# EAGLE design trans-emu (EAGLE 9.6.2)
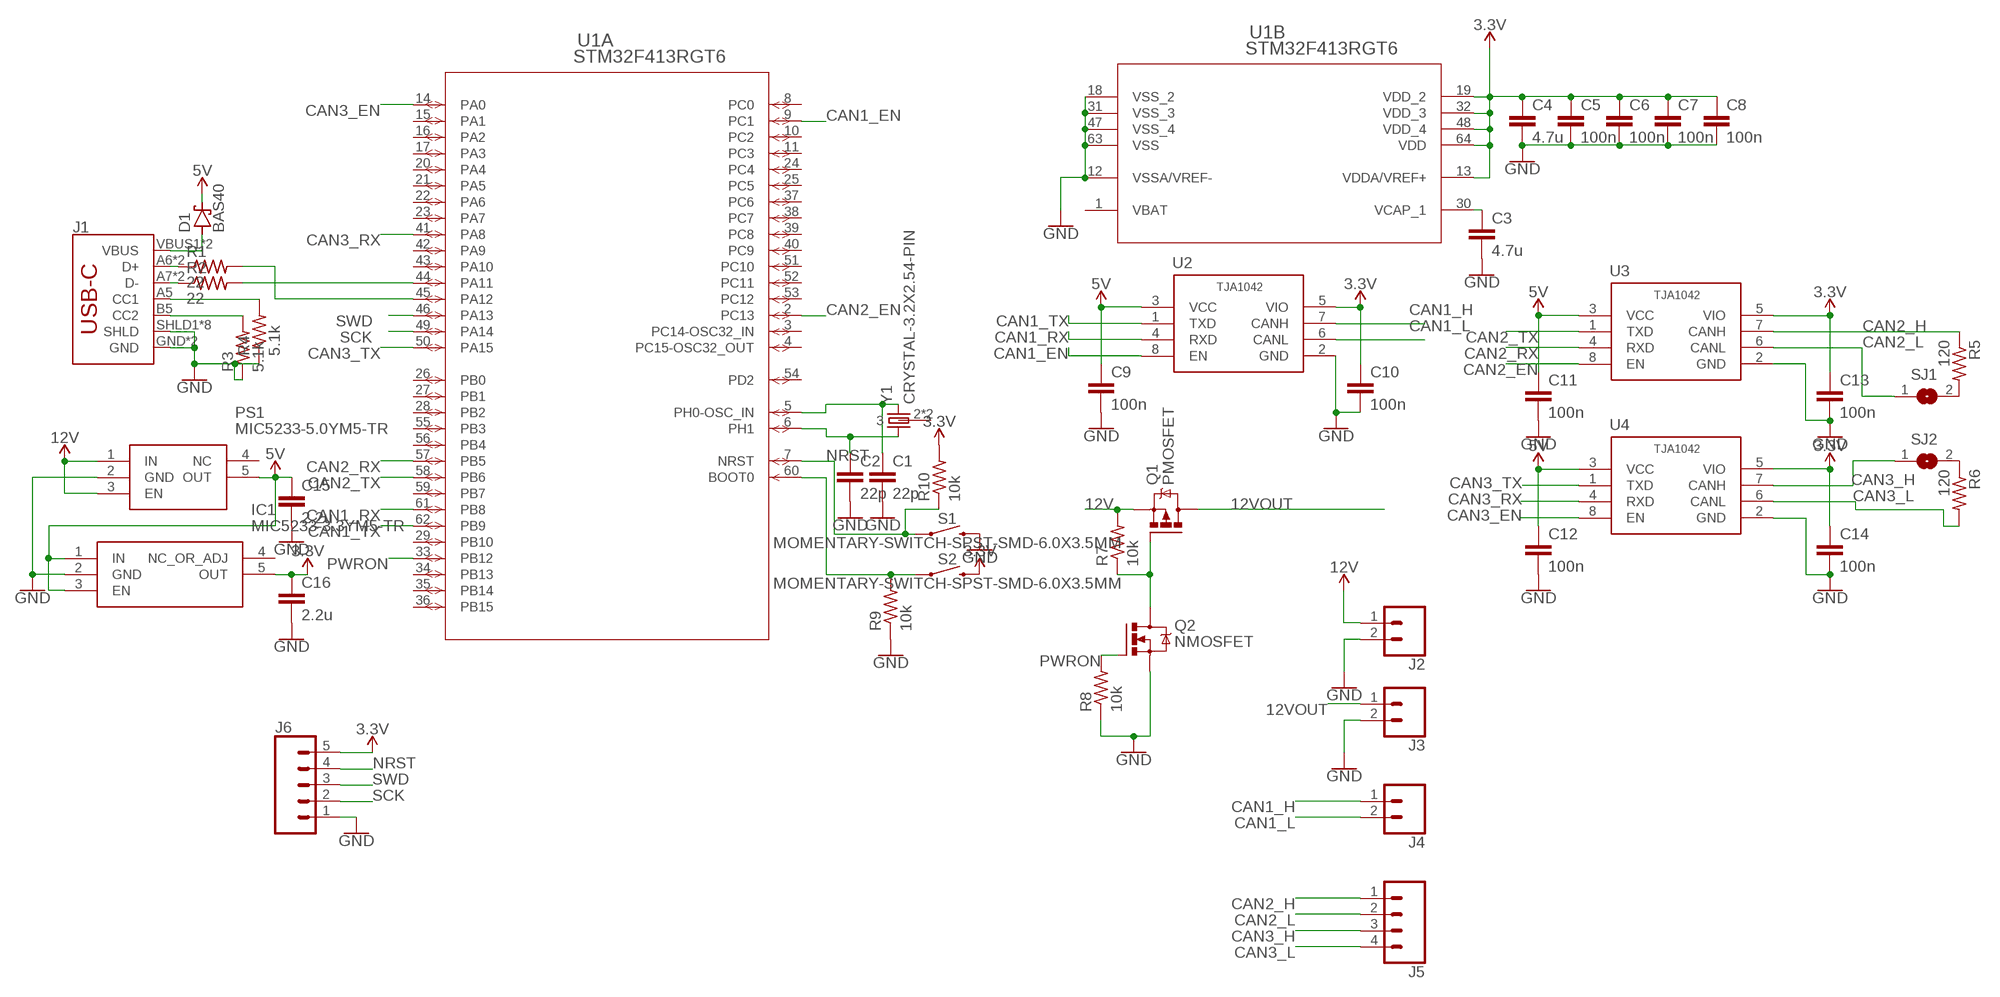
[diagram p0: schematic, sheet 1]

## Parts
C1  22p  C0603  [0603-C]
C2  22p  C0603  [0603-C]
C3  4.7u  C0603  [0603-C]
C4  4.7u  C0603  [0603-C]
C5  100n  C0603  [0603-C]
C6  100n  C0603  [0603-C]
C7  100n  C0603  [0603-C]
C8  100n  C0603  [0603-C]
C9  100n  C0603  [0603-C]
C10  100n  C0603  [0603-C]
C11  100n  C0603  [0603-C]
C12  100n  C0603  [0603-C]
C13  100n  C0603  [0603-C]
C14  100n  C0603  [0603-C]
C15  2.2u  C0603  [0603-C]
C16  2.2u  C0603  [0603-C]
D1  BAS40  [SOT23]
IC1  MIC5233-3.3YM5-TR  [SOT95P280X145-5N]
J1  USB-C-BREAKOUT_SPARKFUN-CONNECTORS_USB_C16PIN  [USB-C-BREAKOUT_SPARKFUN-CONNECTORS_USB-C-16P]
J2  CONN_02  [1X02]
J3  CONN_02  [1X02]
J4  CONN_02  [1X02]
J5  CONN_04  [1X04]
J6  CONN_051.27MM  [1X05_1.27MM]
PS1  MIC5233-5.0YM5-TR  [SOT95P280X145-5N]
Q1  PMOSFET  PMOSFET_SOT23  [SOT23]
Q2  NMOSFET  NMOSFETSOT23  [SOT23]
R1  22  R0402  [0402-R]
R2  22  R0402  [0402-R]
R3  5.1k  R0402  [0402-R]
R4  5.1k  R0402  [0402-R]
R5  120  R0402  [0402-R]
R6  120  R0402  [0402-R]
R7  10k  R0402  [0402-R]
R8  10k  R0402  [0402-R]
R9  10k  R0402  [0402-R]
R10  10k  R0402  [0402-R]
S1  MOMENTARY-SWITCH-SPST-SMD-6.0X3.5MM  [TACTILE_SWITCH_SMD_6.0X3.5MM]
S2  MOMENTARY-SWITCH-SPST-SMD-6.0X3.5MM  [TACTILE_SWITCH_SMD_6.0X3.5MM]
SJ1  SJ  [SJ]
SJ2  SJ  [SJ]
U1  STM32F413RGT6  [LQFP64-10X10MM]
U2  TJA1042  [NXP_SEMICONDUCTORS_TJA1042T-3-CM_118_0]
U3  TJA1042  [NXP_SEMICONDUCTORS_TJA1042T-3-CM_118_0]
U4  TJA1042  [NXP_SEMICONDUCTORS_TJA1042T-3-CM_118_0]
Y1  CRYSTAL-3.2X2.54-PIN  [XTAL-3.2X2.5]

## Nets
3.3V: C4.1 C5.1 C6.1 C7.1 C8.1 C10.1 C13.1 C14.1 C16.1 IC1.5(OUT) J6.5 R10.2 S2.2 U1.13(B:VDDA/VREF+) U1.19(B:VDD_2) U1.32(B:VDD_3) U1.48(B:VDD_4) U1.64(B:VDD) U2.5(VIO) U3.5(VIO) U4.5(VIO)
5V: C9.1 C11.1 C12.1 C15.1 D1.3(C) IC1.1(IN) IC1.3(EN) PS1.5(OUT) U2.3(VCC) U3.3(VCC) U4.3(VCC)
12V: J2.1 PS1.1(IN) PS1.3(EN) Q1.2(S) R7.2
12VOUT: J3.1 Q1.3(D)
CAN1_EN: U1.9(A:PC1) U2.8(EN)
CAN1_H: J4.1 U2.7(CANH)
CAN1_L: J4.2 U2.6(CANL)
CAN1_RX: U1.61(A:PB8) U2.4(RXD)
CAN1_TX: U1.62(A:PB9) U2.1(TXD)
CAN2_EN: U1.2(A:PC13) U3.8(EN)
CAN2_H: J5.1 R5.1 U3.7(CANH)
CAN2_L: J5.2 SJ1.1 U3.6(CANL)
CAN2_RX: U1.57(A:PB5) U3.4(RXD)
CAN2_TX: U1.58(A:PB6) U3.1(TXD)
CAN3_EN: U1.14(A:PA0) U4.8(EN)
CAN3_H: J5.3 SJ2.1 U4.7(CANH)
CAN3_L: J5.4 R6.2 U4.6(CANL)
CAN3_RX: U1.41(A:PA8) U4.4(RXD)
CAN3_TX: U1.50(A:PA15) U4.1(TXD)
GND: C1.2 C2.2 C3.2 C4.2 C5.2 C6.2 C7.2 C8.2 C9.2 C10.2 C11.2 C12.2 C13.2 C14.2 C15.2 C16.2 IC1.2(GND) J1.GND J1.GND2(GND) J1.SHLD1(SHLD) J1.SHLD2(SHLD) J1.SHLD3(SHLD) J1.SHLD4(SHLD) J1.SHLD5(SHLD) J1.SHLD6(SHLD) J1.SHLD7(SHLD) J1.SHLD8(SHLD) J2.2 J3.2 J6.1 PS1.2(GND) Q2.2(S) R3.1 R4.1 R8.1 R9.1 S1.2 U1.12(B:VSSA/VREF-) U1.18(B:VSS_2) U1.31(B:VSS_3) U1.47(B:VSS_4) U1.63(B:VSS) U2.2(GND) U3.2(GND) U4.2(GND)
N$1: C1.1 U1.5(A:PH0-OSC_IN) Y1.3
N$2: C2.1 U1.6(A:PH1) Y1.1
N$3: R2.2 U1.44(A:PA11)
N$4: R1.2 U1.45(A:PA12)
N$5: D1.1(A) J1.VBUS1(VBUS) J1.VBUS2(VBUS)
N$6: J1.A5(CC1) R4.2
N$7: J1.B5(CC2) R3.2
N$9: R9.2 S2.1 U1.60(A:BOOT0)
N$10: J1.A6(D+) J1.B6(D+) R1.1
N$11: J1.A7(D-) J1.B7(D-) R2.1
N$12: R5.2 SJ1.2
N$13: C3.1 U1.30(B:VCAP_1)
N$14: R6.1 SJ2.2
N$16: Q1.1(G) Q2.3(D) R7.1
NRST: J6.4 R10.1 S1.1 U1.7(A:NRST)
PWRON: Q2.1(G) R8.2 U1.33(A:PB12)
SCK: J6.2 U1.49(A:PA14)
SWD: J6.3 U1.46(A:PA13)
Unconnected: IC1.4(NC_OR_ADJ) PS1.4(NC) U1.3(A:PC14-OSC32_IN) U1.4(A:PC15-OSC32_OUT) U1.8(A:PC0) U1.10(A:PC2) U1.11(A:PC3) U1.15(A:PA1) U1.16(A:PA2) U1.17(A:PA3) U1.20(A:PA4) U1.21(A:PA5) U1.22(A:PA6) U1.23(A:PA7) U1.24(A:PC4) U1.25(A:PC5) U1.26(A:PB0) U1.27(A:PB1) U1.28(A:PB2) U1.29(A:PB10) U1.34(A:PB13) U1.35(A:PB14) U1.36(A:PB15) U1.37(A:PC6) U1.38(A:PC7) U1.39(A:PC8) U1.40(A:PC9) U1.42(A:PA9) U1.43(A:PA10) U1.51(A:PC10) U1.52(A:PC11) U1.53(A:PC12) U1.54(A:PD2) U1.55(A:PB3) U1.56(A:PB4) U1.59(A:PB7) Y1.2 Y1.4

## Power pins joined to a net without a drawn wire
VBAT: U1.1(B:VBAT)

## Library data of the parts
C1-C16 = comma.ai:C
D1 = diode:BAS40: Silicon Schottky Diodes General-purpose diode for high-speed switching
IC1 = SamacSys_Parts:MIC5233-3.3YM5-TR: High Input Voltage Low IQ UCAP LDO Regulator Source: Datasheet <http://ww1.microchip.com/downloads/en/DeviceDoc/MIC5233-Data-Sheet-DS20006033D.pdf>; DESCRIPTION: High Input Voltage Low IQ UCAP LDO Regulator; HEIGHT: 1.45mm; MANUFACTURER_NAME: Microchip; MANUFACTURER_PART_NUMBER: MIC5233-3.3YM5-TR; MOUSER_PART_NUMBER: 998-MIC5233-3.3YM5TR; MOUSER_PRICE-STOCK: https://www.mouser.co.uk/ProductDetail/Microchip-Technology-Micrel/MIC5233-33YM5-TR?qs=U6T8BxXiZAWDhshLMgpaLQ%3D%3D
J1 = ROTR-Wireless:USB-C-BREAKOUT_SPARKFUN-CONNECTORS_USB_C: USB Type C 16Pin Connector Super Speed pins not available on the 16-pin purely SMD connector so this part is best for USB 2.0 implementations. D1 and D2 are tied together enabling D+/- no matter which way the cable is plugged into the connector. The two channel configuration pins (CC1/2) are exposed. These are normally connected to ground via 5.1k resistors but can be reconfigured for high current/high power applications.; PROD_ID: CONN-14122
J2-J4 = SparkFun-Connectors:CONN_02: Multi connection point. Often used as Generic Header-pin footprint for 0.1 inch spaced/style header connections On any of the 0.1 inch spaced packages, you can populate with these: Break Away Headers - Straight <https://www.sparkfun.com/products/116> (PRT-00116) Break Away Male Headers - Right Angle <https://www.sparkfun.com/products/553> (PRT-00553) Female Headers <https://www.sparkfun.com/products/115> (PRT-00115) Break Away Headers - Machine Pin <https://www.sparkfun.com/products/117> (PRT-00117) Break Away Female Headers - Swiss Machine Pin <https://www.sparkfun.com/products/743> (PRT-00743) For SCREWTERMINALS and SPRING TERMINALS visit here: Screw Terimnals on SparkFun.com <https://www.sparkfun.com/search/results?term=Screw+Terminals> (5mm/3.5mm/2.54mm spacing) This device is also useful as a general connection point to wire up your design to another part of your project. Our various solder wires solder well into these plated through hole pads. Hook-Up Wire - Assortment (Stranded, 22 AWG) <https://www.sparkfun.com/products/11375> (PRT-11375) Hook-Up Wire - Assortment (Solid Core, 22 AWG) <https://www.sparkfun.com/products/11367> (PRT-11367) View the entire wire category on our website here <https://www.sparkfun.com/categories/141> Special notes: Molex polarized connector foot print use with: PRT-08233 with associated crimp pins and housings. 2.54_SCREWTERM for use with PRT-10571. 3.5mm Screw Terminal footprints for PRT-08084 5mm Screw Terminal footprints for use with PRT-08432
J5 = SparkFun-Connectors:CONN_04: Multi connection point. Often used as Generic Header-pin footprint for 0.1 inch spaced/style header connections On any of the 0.1 inch spaced packages, you can populate with these: Break Away Headers - Straight <https://www.sparkfun.com/products/116> (PRT-00116) Break Away Male Headers - Right Angle <https://www.sparkfun.com/products/553> (PRT-00553) Female Headers <https://www.sparkfun.com/products/115> (PRT-00115) Break Away Headers - Machine Pin <https://www.sparkfun.com/products/117> (PRT-00117) Break Away Female Headers - Swiss Machine Pin <https://www.sparkfun.com/products/743> (PRT-00743) For SCREWTERMINALS and SPRING TERMINALS visit here: Screw Terimnals on SparkFun.com <https://www.sparkfun.com/search/results?term=Screw+Terminals> (5mm/3.5mm/2.54mm spacing) This device is also useful as a general connection point to wire up your design to another part of your project. Our various solder wires solder well into these plated through hole pads. Hook-Up Wire - Assortment (Stranded, 22 AWG) <https://www.sparkfun.com/products/11375> (PRT-11375) Hook-Up Wire - Assortment (Solid Core, 22 AWG) <https://www.sparkfun.com/products/11367> (PRT-11367) View the entire wire category on our website here <https://www.sparkfun.com/categories/141> Special notes: Molex polarized connector foot print use with SKU : PRT-08231 with associated crimp pins and housings. 1MM SMD Version SKU: PRT-10208; PROD_ID: CONN-09696
J6 = SparkFun-Connectors:CONN_05: Multi connection point. Often used as Generic Header-pin footprint for 0.1 inch spaced/style header connections On any of the 0.1 inch spaced packages, you can populate with these: Break Away Headers - Straight <https://www.sparkfun.com/products/116> (PRT-00116) Break Away Male Headers - Right Angle <https://www.sparkfun.com/products/553> (PRT-00553) Female Headers <https://www.sparkfun.com/products/115> (PRT-00115) Break Away Headers - Machine Pin <https://www.sparkfun.com/products/117> (PRT-00117) Break Away Female Headers - Swiss Machine Pin <https://www.sparkfun.com/products/743> (PRT-00743) For SCREWTERMINALS and SPRING TERMINALS visit here: Screw Terimnals on SparkFun.com <https://www.sparkfun.com/search/results?term=Screw+Terminals> (5mm/3.5mm/2.54mm spacing) This device is also useful as a general connection point to wire up your design to another part of your project. Our various solder wires solder well into these plated through hole pads. Hook-Up Wire - Assortment (Stranded, 22 AWG) <https://www.sparkfun.com/products/11375> (PRT-11375) Hook-Up Wire - Assortment (Solid Core, 22 AWG) <https://www.sparkfun.com/products/11367> (PRT-11367) View the entire wire category on our website here <https://www.sparkfun.com/categories/141> Special notes: Molex polarized connector foot print use with SKU : PRT-08231 with associated crimp pins and housings. 1MM SMD Version SKU: PRT-10208
PS1 = SamacSys_Parts:MIC5233-5.0YM5-TR: MICROCHIP - MIC5233-5.0YM5-TR - LDO, REG, 36VIN, 0.1A, 5V, 2%, 5SOT23 Source: Datasheet <https://componentsearchengine.com/Datasheets/2/MIC5233-5.0YM5-TR.pdf>; DESCRIPTION: MICROCHIP - MIC5233-5.0YM5-TR - LDO, REG, 36VIN, 0.1A, 5V, 2%, 5SOT23; HEIGHT: 1.45mm; MANUFACTURER_NAME: Microchip; MANUFACTURER_PART_NUMBER: MIC5233-5.0YM5-TR; MOUSER_PART_NUMBER: 998-MIC5233-5.0YM5TR; MOUSER_PRICE-STOCK: https://www.mouser.co.uk/ProductDetail/Microchip-Technology-Micrel/MIC5233-50YM5-TR?qs=U6T8BxXiZAWSnpCHgrMajw%3D%3D
Q1 = Transistor:PMOSFET: P-Channel MOSFET - Generic; CATEGORY: Transistor; SUB-CATEGORY: MOSFET; TYPE: P-Channel
Q2 = Transistor:NMOSFET: N-Channel MOSFET - Generic; CATEGORY: Transistor; SUB-CATEGORY: MOSFET; TYPE: N-Channel
R1-R10 = comma.ai:R
S1 S2 = SparkFun-Switches:MOMENTARY-SWITCH-SPST: Momentary Switch (Pushbutton) - SPST Normally-open (NO) SPST momentary switches (buttons, pushbuttons). Variants PTH-12MM - 12mm square, through-hole Momentary Pushbutton Switch - 12mm Square <https://www.sparkfun.com/products/9190> (COM-09190) PTH-6.0MM, PTH-6.0MM-KIT - 6.0mm square, through-hole Mini Pushbutton Switch <https://www.sparkfun.com/products/97> (COM-00097) KIT package intended for soldering kit's - only one side of pads' copper is exposed. PTH-RIGHT-ANGLE-KIT - Right-angle, through-hole Right Angle Tactile Button <https://www.sparkfun.com/products/10791> - Used on SparkFun BigTime Watch Kit <https://www.sparkfun.com/products/11734> SMD-12MM - 12mm square, surface-mount Tactile Button - SMD (12mm) <https://www.sparkfun.com/products/12993> (COM-12993) Used on SparkFun PicoBoard <https://www.sparkfun.com/products/11888> SMD-4.5MM - 4.5mm Square Trackball Switch Used on SparkFun Blackberry Trackballer Breakout <https://www.sparkfun.com/products/13169> SMD-4.6MMX2.8MM - 4.60mm x 2.80mm, surface mount Used on SparkFun SAMD21 Mini Breakout <https://www.sparkfun.com/products/13664> SMD-5.2MM, SMD-5.2-REDUNDANT - 5.2mm square, surface-mount Mini Pushbutton Switch - SMD <https://www.sparkfun.com/products/8720> (COM-08720) Used on Arduino Pro Mini <https://www.sparkfun.com/products/11114> REDUNDANT package connects both switch circuits together SMD-6.0X3.5MM - 6.0 x 3.5mm, surface mount Momentary Reset Switch SMD <https://www.sparkfun.com/products/8229> (COM-08229) SMD-6.2MM-TALL - 6.2mm square, surface mount Tactile Button - SMD (6mm) <https://www.sparkfun.com/products/12992> Used on SparkFun Digital Sandbox <https://www.sparkfun.com/products/12651> SMD-RIGHT-ANGLE - Right-angle, surface mount Used on SparkFun Block for Intel® Edison - Arduino <https://www.sparkfun.com/products/13036>; PROD_ID: SWCH-00815; SF_SKU: COM-08229
SJ1 SJ2 = jumper:SJ: SMD solder JUMPER
U1 = interceptor:STM32F413RGT6; BUILT_BY: EMA_UL_Team; COPYRIGHT: Copyright (C) 2018 Accelerated Designs. All rights reserved; MANUFACTURER_PART_NUMBER: STM32F413RGT6; SOURCELIBRARY: Updates_to_database_2020-10-19; VENDOR: STMicroelectronics
U2-U4 = CM,118:TJA1042
Y1 = comma.ai:CRYSTAL-3.2X2.5

## Board
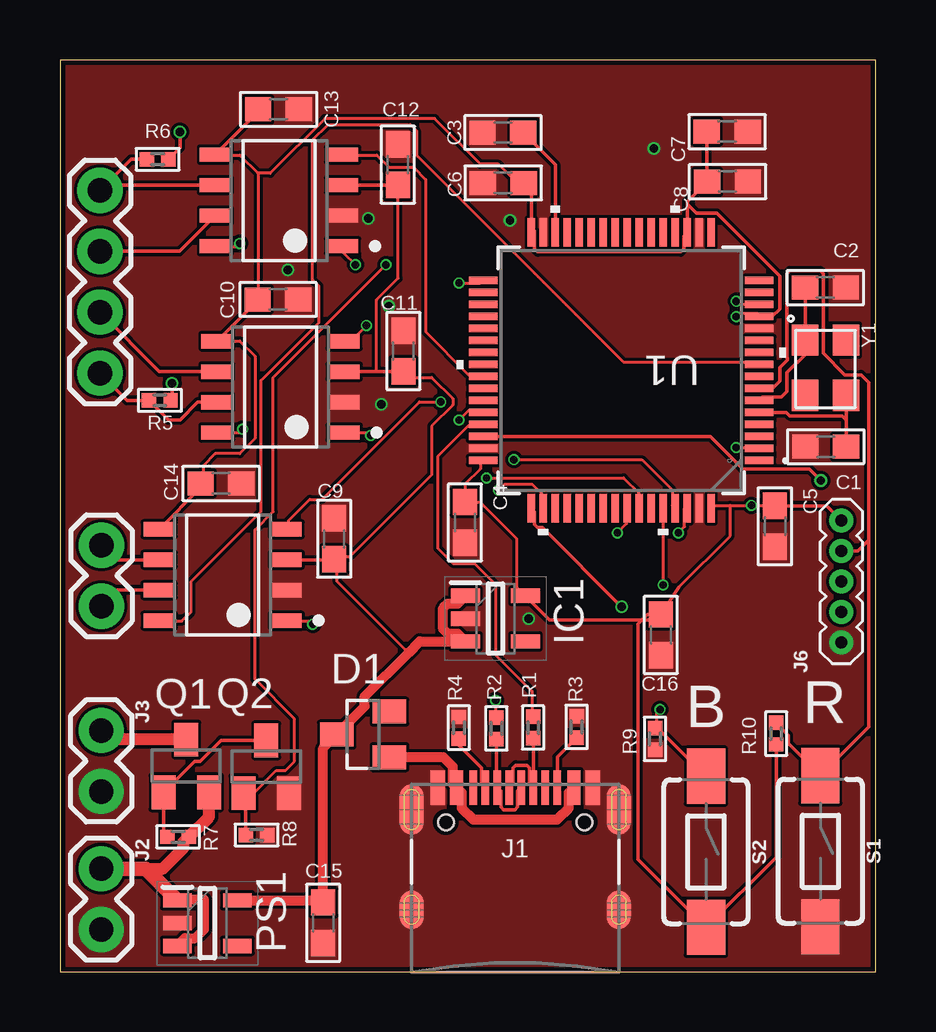
[diagram p1: board, top side]
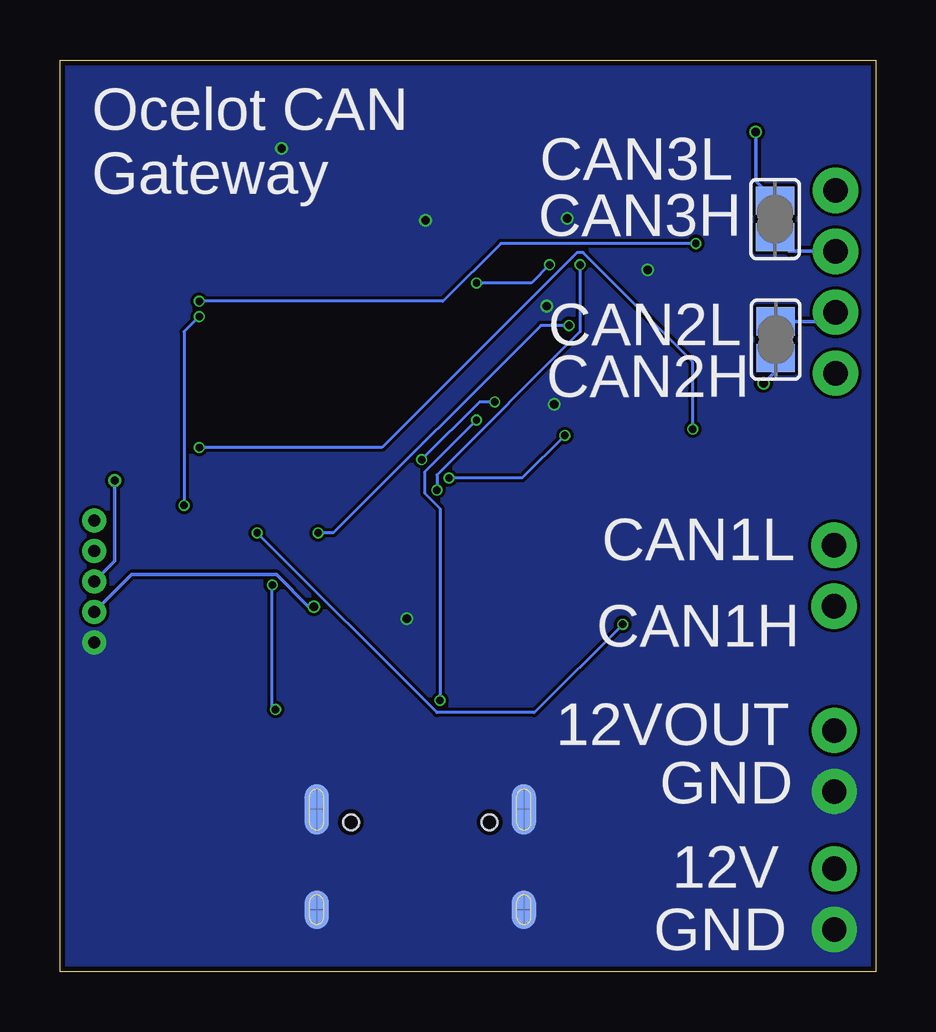
[diagram p2: board, bottom side, seen from below]

Size 34 x 38 mm. Coordinates in mm from the lower left corner, seen from the top.
Outline: 0,0 34,0 34,38 0,38 0,0
Copper layers (1*16): Top 0.035559375mm / dielectric 1.6mm / Bottom 0.035559375mm
Design rules "jlcpcb2layer": minimum track width 5mil, minimum drill 12mil, track to track 5mil, track to pad 5mil, pad to pad 5mil, via to via 5mil, smd to smd 5mil, copper to edge 8mil, drill to drill 6mil, minimum pad ring 5mil, minimum via ring 3mil, stop-mask expansion 2.5mil, vias tented up to drill 0mil, thermal gap 10mil

### Footprints (pad centres in the part's own frame; a part is rotated, then mirrored left to right if it is on the bottom)
0603-C = smd 1.1 x 1: 1 -0.85,0; 2 0.85,0
SOT23 = smd 1 x 1.4: 1 -0.95,-1.1; 2 0.95,-1.1; 3 0,1.1
SOT95P280X145-5N = smd 1.2 x 0.6: 1 -1.25,0.95; 2 -1.25,0; 3 -1.25,-0.95; 4 1.25,-0.95; 5 1.25,0.95
USB-C-BREAKOUT_SPARKFUN-CONNECTORS_USB-C-16P = smd 0.3 x 1.45: A5 -1.25,0; A6 -0.25,0; A7 0.25,0; A8 1.25,0; B5 1.75,0; B6 0.75,0; B7 -0.75,0; B8 -1.75,0 | smd 0.6 x 1.45: GND -3.225,0; GND2 3.225,0 | smd 1 x 2.1: SHLD1 -4.32,-0.915; SHLD2 4.32,-0.915 | smd 1 x 2.1 bottom: SHLD3 -4.32,-0.915; SHLD4 4.32,-0.915 | smd 1 x 1.6: SHLD5 -4.32,-5.095; SHLD8 4.32,-5.095 | smd 1 x 1.6 bottom: SHLD6 -4.32,-5.095; SHLD7 4.32,-5.095 | smd 0.55 x 1.45: VBUS1 -2.45,0; VBUS2 2.45,0 | hole 0.65: -2.89,-1.445; 2.89,-1.445
1X02 = drill 1.016 pad 1.88: 1 0,0; 2 2.54,0
1X04 = drill 1.016 pad 1.88: 1 0,0; 2 2.54,0; 3 5.08,0; 4 7.62,0
1X05_1.27MM = drill 0.508 pad 1: 1 0,0; 2 1.27,0; 3 2.54,0; 4 3.81,0; 5 5.08,0
0402-R = smd 0.6 x 0.6: 1 -0.45,0; 2 0.45,0
TACTILE_SWITCH_SMD_6.0X3.5MM = smd 2.3 x 1.6: 1 -3.15,0; 2 3.15,0
SJ = smd 1.168 x 1.6: 1 -0.762,0; 2 0.762,0
LQFP64-10X10MM = smd 1.194 x 0.305: 1 -5.75,3.75; 2 -5.75,3.25; 3 -5.75,2.75; 4 -5.75,2.25; 5 -5.75,1.75; 6 -5.75,1.25; 7 -5.75,0.75; 8 -5.75,0.25; 9 -5.75,-0.25; 10 -5.75,-0.75; 11 -5.75,-1.25; 12 -5.75,-1.75; 13 -5.75,-2.25; 14 -5.75,-2.75; 15 -5.75,-3.25; 16 -5.75,-3.75; 33 5.75,-3.75; 34 5.75,-3.25; 35 5.75,-2.75; 36 5.75,-2.25; 37 5.75,-1.75; 38 5.75,-1.25; 39 5.75,-0.75; 40 5.75,-0.25; 41 5.75,0.25; 42 5.75,0.75; 43 5.75,1.25; 44 5.75,1.75; 45 5.75,2.25; 46 5.75,2.75; 47 5.75,3.25; 48 5.75,3.75 | smd 0.305 x 1.194: 17 -3.75,-5.75; 18 -3.25,-5.75; 19 -2.75,-5.75; 20 -2.25,-5.75; 21 -1.75,-5.75; 22 -1.25,-5.75; 23 -0.75,-5.75; 24 -0.25,-5.75; 25 0.25,-5.75; 26 0.75,-5.75; 27 1.25,-5.75; 28 1.75,-5.75; 29 2.25,-5.75; 30 2.75,-5.75; 31 3.25,-5.75; 32 3.75,-5.75; 49 3.75,5.75; 50 3.25,5.75; 51 2.75,5.75; 52 2.25,5.75; 53 1.75,5.75; 54 1.25,5.75; 55 0.75,5.75; 56 0.25,5.75; 57 -0.25,5.75; 58 -0.75,5.75; 59 -1.25,5.75; 60 -1.75,5.75; 61 -2.25,5.75; 62 -2.75,5.75; 63 -3.25,5.75; 64 -3.75,5.75
NXP_SEMICONDUCTORS_TJA1042T-3-CM_118_0 = smd 1.3 x 0.6: 1 -2.65,1.905; 2 -2.65,0.635; 3 -2.65,-0.635; 4 -2.65,-1.905; 5 2.65,-1.905; 6 2.65,-0.635; 7 2.65,0.635; 8 2.65,1.905
XTAL-3.2X2.5 = smd 1.3 x 1.1: 1 0,-1.8; 2 2.3,-1.8; 3 2.3,-0.1; 4 0,-0.1

### Placement (x,y rotation side)
C1  31.92,21.88 180 top
C2  31.91,28.51 0 top
C3  18.47,34.98 180 top
C4  16.88,18.72 270 top
C5  29.8,18.56 270 top
C6  18.48,32.87 180 top
C7  27.81,35.01 0 top
C8  27.83,32.93 0 top
C9  11.43,18.04 90 top
C10  9.09,28.01 0 top
C11  14.32,25.87 90 top
C12  14.08,33.64 90 top
C13  9.11,35.94 0 top
C14  6.71,20.34 0 top
C15  10.97,2.04 270 top
C16  25.05,14.04 270 top
D1  12.63,9.88 90 top
IC1  18.16,14.71 0 top
J1  18.98,7.67 0 top
J2  1.72,4.29 270 top
J3  1.72,10.05 270 top
J4  1.73,15.23 90 top
J5  1.67,24.94 90 top
J6  32.57,13.72 90 top
PS1  6.15,2.02 0 top
Q1  5.26,8.57 0 top
Q2  8.6,8.54 0 top
R1  19.73,10.17 90 top
R2  18.19,10.14 90 top
R3  21.53,10.2 270 top
R4  16.63,10.16 270 top
R5  4.16,23.81 0 top
R6  4.07,33.86 180 top
R7  4.92,5.61 0 top
R8  8.19,5.69 180 top
R9  24.81,9.69 90 top
R10  29.86,9.92 270 top
S1  31.7,5.02 270 top
S2  26.93,4.99 270 top
SJ1  4.16,26.34 270 bottom
SJ2  4.19,31.37 90 bottom
U1  23.4,25.06 180 top
U2  6.78,16.53 180 top
U3  9.19,24.37 180 top
U4  9.13,32.15 180 top
Y1  32.87,26.32 270 top

### Tracks (layer width: path | path; a pad name or v marks a point on that pad's centre or on a via)
3.3V  (via drill 0.3)
  Top 0.127: 27.94,19.43 27.18,19.43 U1.64 | 27.94,19.43 v28.83,19.43 29.72,19.43 C5.1 | U1.48 17.53,21.21 17.53,20.95 16.89,20.32 16.89,19.68 C4.1 16.89,19.56 17.53,19.56 19.05,18.03 19.05,16 19.3,15.75 IC1.5 | 27.94,19.43 27.94,18.16 25.81,16.03 C16.1 | 8.26,33.27 8.26,28.07 C10.1 | 8.26,33.27 7.49,34.04 6.6,34.04 U4.5 | C14.1 5.97,20.45 5.97,21.08 6.48,21.59 7.49,21.59 8.13,22.23 8.13,25.65 7.49,26.29 7.11,26.29 6.86,26.54 U3.5 | 8.26,33.27 8.76,33.27 11.05,35.56 15.62,35.56 17.53,33.66 18.29,33.66 19.05,32.89 19.3,32.89 C6.1 | v28.19,27.3 28.32,27.43 29.08,27.43 U1.13
  Top 0.152: R10.2 29.86,4.77 S2.2 24.1,4.67 24.1,14.49 24.49,14.88 C16.1 24.82,14.66 20.41,14.66 IC1.5 | U2.5 5.86,20.17 C14.1 | U4.5 8.26,35.84 C13.1 | U3.5 8.24,27.97 C10.1 | C6.1 19.65,32.55 19.65,31 | 19.65,31 U1.32 | 26.15,32 U1.19 26,30.66 26,30.13 25.88,30.01 19.91,30.01 19.79,30.13 19.79,30.86 19.65,31 | 26.15,32 26.15,32.09 C8.1 26.98,35 C7.1 | 26.15,32 26.54,31.61 27.38,31.61 30,28.99 30,27.62 29.68,27.31 U1.13 | J6.5 31.97,19.41 C5.1
  Bottom 0.127: v28.83,19.43 28.83,26.67 v28.19,27.3
5V
  Top 0.127: 14.52,13.29 11.56,16.26 11.56,17.14 C9.1 11.56,17.27 12.06,17.27 15.49,20.7 15.49,22.73 16.38,23.62 16.38,23.88 15.49,24.77 14.48,24.77 14.35,24.89 C11.1 | 13.21,25.01 13.21,28.01 14.1,28.9 14.1,32.77 C12.1
  Top 0.152: U2.3 11.41,17.17 C9.1 | U3.3 13.21,25.01 14.31,25.01 C11.1 | U4.3 C12.1
  Top 0.406: PS1.5 10.89,2.97 C15.1 10.97,9.32 D1.3 12.7,11.05 12.7,11.47 14.52,13.29 14.99,13.76 IC1.3 16.59,14.08 16.17,14.08 15.98,14.27 15.98,15.15 16.17,15.34 16.59,15.34 IC1.1
12V
  Top 0.406: PS1.3 5.21,1.39 5.63,1.39 6,1.76 6,3 4.92,3 PS1.1
  Top 0.508: J2.1 4.29,4.29 5.15,5.16 5.15,5.4 R7.2 6.21,6.46 Q1.2
  Top 0.61: PS1.1 3.58,4.29 J2.1
12VOUT
  Top 0.508: Q1.3 2.1,9.67 J3.1
CAN1_EN
  Top 0.127: U1.9 29.08,25.4 23.5,25.4 14.86,34.04 14.86,35.05 14.61,35.31 11.18,35.31 10.54,34.67 10.54,28.83 10.79,28.57 10.79,27.05 8.38,24.64 8.38,19.18 5.46,16.26 5.46,14.99 5.08,14.61 4.19,14.61 U2.8
CAN1_H
  Top 0.152: U2.7 2.4,15.9 J4.1
CAN1_L
  Top 0.152: U2.6 2.33,17.17 J4.2
CAN1_RX  (via drill 0.3)
  Top 0.127: v18.92,21.34 24.26,21.34 25.53,20.07 25.53,19.43 U1.61 | v15.88,23.75 14.99,23.75 10.92,19.68 10.41,19.68 9.53,18.8 9.53,18.54 U2.4
  Bottom 0.127: v18.92,21.34 16.51,23.75 v15.88,23.75
CAN1_TX  (via drill 0.3)
  Top 0.127: v25.78,18.29 26.04,18.54 26.04,19.3 U1.62 | v10.54,14.48 10.41,14.61 9.53,14.61 U2.1
  Bottom 0.127: v25.78,18.29 18.29,10.79 14.22,10.79 v10.54,14.48
CAN2_EN  (via drill 0.3)
  Top 0.127: v28.19,21.84 29.08,21.84 U1.2 | v7.62,22.61 7.49,22.48 6.6,22.48 U3.8
  Bottom 0.127: v28.19,21.84 20.57,21.84 12.45,29.97 12.19,29.97 7.62,25.4 v7.62,22.61
CAN2_H
  Top 0.152: U3.7 5.74,23.74 5,23 4.53,23 R5.1 2.8,23.81 J5.1
CAN2_L
  Top 0.152: U3.6 4.14,25.01 J5.2
  Bottom 0.152: J5.2 2.05,27.1 SJ1.1
CAN2_RX  (via drill 0.3)
  Top 0.127: v23.24,18.29 23.62,18.67 23.62,19.3 U1.57 | v12.77,26.94 12.13,26.29 11.94,26.29 U3.4
  Bottom 0.127: v23.24,18.29 22.61,18.29 13.96,26.94 v12.77,26.94
CAN2_TX  (via drill 0.3)
  Top 0.127: v17.78,20.57 23.5,20.57 24.13,19.94 24.13,19.43 U1.58 | v12.95,22.35 12.83,22.48 11.94,22.48 U3.1
  Bottom 0.127: v17.78,20.57 14.73,20.57 v12.95,22.35
CAN3_EN  (via drill 0.3)
  Top 0.127: v28.19,27.94 28.32,27.81 29.08,27.81 U1.14 | v7.49,30.35 7.37,30.23 6.6,30.23 U4.8
  Bottom 0.127: v28.19,27.94 18.03,27.94 15.62,30.35 v7.49,30.35
CAN3_H
  Top 0.152: J5.3 4.99,30.02 U4.7
  Bottom 0.152: J5.3 3.6,30.02 SJ2.1
CAN3_L
  Top 0.152: R6.2 2.97,33.86 J5.4 1.89,32.78 U4.6
CAN3_RX
  Top 0.127: U1.41 17.53,24.89 17.02,24.89 15.24,26.67 15.24,33.02 14.73,33.53 13.72,33.53 13.21,34.04 11.81,34.04 U4.4
CAN3_TX  (via drill 0.3)
  Top 0.127: v18.29,20.07 18.54,20.32 19.68,20.32 20.07,19.94 20.07,19.43 U1.50 | v12.32,29.46 11.81,29.97 11.81,30.23 U4.1
  Bottom 0.127: v18.29,20.07 18.29,20.7 12.32,26.67 v12.32,29.46
GND  (via drill 0.35)
  other vias: 9.49,29.26 13.7,27.74 12.86,31.4 19.54,14.72 13.4,23.64 18.76,31.31 24.76,34.31
  pour Bottom (no thermals): 0,38 34,38 34,0 0,0
  pour Top (no thermals): 0,0 0,38 34,38 34,0
N$1
  Top 0.152: C1.1 32.77,23 | 32.77,23 Y1.3 | U1.5 30.29,23.31 30.43,23.17 32.61,23.17 32.77,23
N$2
  Top 0.152: U1.6 29.29,23.95 30.07,23.95 30.3,24.18 30.3,24.96 31.07,25.73 Y1.1 C2.1
N$3  (via drill 0.3)
  Top 0.127: v18.16,11.3 18.16,10.67 R2.2 | v16.64,22.99 17.02,23.37 17.53,23.37 U1.44
  Bottom 0.127: v18.16,11.3 18.16,19.3 18.8,19.94 18.8,20.83 v16.64,22.99
N$4
  Top 0.127: R1.2 19.68,10.67 19.68,11.68 18.16,13.21 18.16,16.13 17.27,17.02 16.38,17.02 15.75,17.65 15.75,21.46 17.02,22.73 17.53,22.73 U1.45
N$5
  Top 0.406: J1.VBUS2 21.21,7.45 21.21,6.81 20.74,6.33 17.22,6.33 16.75,6.81 16.75,7.45 J1.VBUS1 16.39,7.82 16.39,8.53 15.98,8.94 D1.1
N$6
  Top 0.152: J1.A5 17.58,7.82 17.58,8.48 16.63,9.43 R4.2
N$7
  Top 0.152: J1.B5 20.73,8.94 R3.2
N$9  (via drill 0.3)
  Top 0.127: v25.15,16.12 U1.60 | v25.02,10.92 24.89,10.79 24.89,10.16 R9.2
  Top 0.152: S2.1 24.93,10.14 R9.2
  Bottom 0.127: v25.15,16.12 25.15,11.05 v25.02,10.92
N$10
  Top 0.152: J1.A6 18.88,7.82 18.88,8.48 19,8.6 19.46,8.6 19.58,8.48 19.58,7.82 J1.B6 R1.1
N$11
  Top 0.152: J1.A7 19.08,7.52 19.08,6.86 18.96,6.74 18.5,6.74 18.38,6.86 18.38,7.52 J1.B7 18.19,7.71 R2.1
N$12  (via drill 0.35)
  Top 0.152: v4.67,24.52 4.67,23.87 R5.2
  Bottom 0.152: v4.67,24.52 4.16,25.03 SJ1.2
N$13
  Top 0.152: C3.1 20.65,33.65 U1.30
N$14  (via drill 0.35)
  Top 0.152: R6.1 5,34.34 v5,35
  Bottom 0.152: v5,35 5,32.94 SJ2.2
N$16
  Top 0.152: R7.1 4.32,5.77 Q1.1 5.61,8.77 5.85,8.77 6.72,9.64 Q2.3
NRST
  Top 0.152: R10.1 29.86,10.36 30.36,9.85 30.36,9.51 S1.1 33.72,10.19 33.72,18 | U1.7 29.7,24.31 30.02,24.62 30.02,25.19 30.33,25.5 30.33,25.57 30.31,25.59 30.31,29.09 30.43,29.21 31.69,29.21 31.82,29.09 31.82,25.78 32.73,24.87 33.4,24.87 33.72,24.55 33.72,18 | J6.4 33.26,17.53 33.72,18
PWRON  (via drill 0.3)
  Top 0.127: v16.64,28.7 17.53,28.7 U1.33 | v13.59,29.46 8.89,24.77 8.89,19.18 8.13,18.41 8.13,12.19 9.78,10.54 9.78,8.76 9.4,8.38 9.02,8.38 8.13,7.49 7.75,7.49 Q2.1
  Top 0.152: R8.2 7.74,7.34 Q2.1
  Bottom 0.127: v16.64,28.7 14.35,28.7 v13.59,29.46
SCK  (via drill 0.35)
  Top 0.152: U1.49 19.79,19.16 19.79,18.63 19.91,18.51 20.11,18.51 v23.41,15.21
  Bottom 0.152: v23.41,15.21 23.63,15.21 24.97,16.55 31.02,16.55 J6.2
SWD  (via drill 0.35)
  Top 0.152: U1.46 27.11,22.31 28.47,20.95 31.24,20.95 v31.72,20.47
  Bottom 0.152: v31.72,20.47 31.72,17.12 J6.3

### Text on the board
tNames: B | R
bNames: CAN3L | CAN3H | Ocelot CAN / Gateway | CAN2L | CAN2H | CAN1L | CAN1H | 12VOUT | GND | 12V | GND